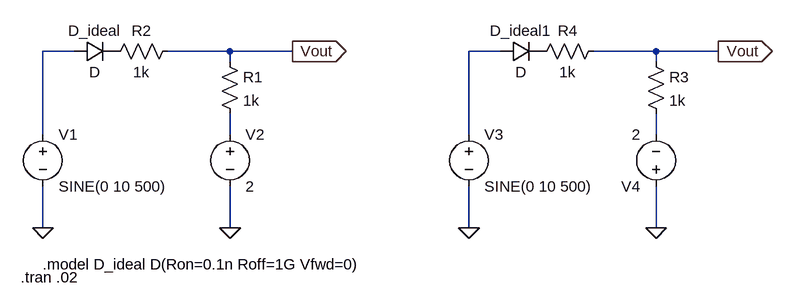
[diagram p0: schematic Q1b.asc]
Q1b.asc, the LTspice schematic file:
Version 4
SHEET 1 1184 680
WIRE 80 80 32 80
WIRE 320 80 224 80
WIRE 416 80 320 80
WIRE 736 80 688 80
WIRE 976 80 880 80
WIRE 1072 80 976 80
WIRE 320 96 320 80
WIRE 976 96 976 80
WIRE 32 208 32 80
WIRE 320 208 320 176
WIRE 688 208 688 80
WIRE 976 208 976 176
WIRE 32 352 32 288
WIRE 320 352 320 288
WIRE 688 352 688 288
WIRE 976 352 976 288
FLAG 32 352 0
FLAG 320 352 0
FLAG 416 80 Vout
IOPIN 416 80 Out
FLAG 688 352 0
FLAG 976 352 0
FLAG 1072 80 Vout
IOPIN 1072 80 Out
SYMBOL voltage 32 192 R0
WINDOW 123 0 0 Left 0
WINDOW 39 0 0 Left 0
SYMATTR InstName V1
SYMATTR Value SINE(0 10 500)
SYMBOL voltage 320 192 R0
WINDOW 123 0 0 Left 0
WINDOW 39 0 0 Left 0
SYMATTR InstName V2
SYMATTR Value 2
SYMBOL res 304 80 R0
SYMATTR InstName R1
SYMATTR Value 1k
SYMBOL res 240 64 R90
WINDOW 0 0 56 VBottom 2
WINDOW 3 32 56 VTop 2
SYMATTR InstName R2
SYMATTR Value 1k
SYMBOL diode 80 96 R270
WINDOW 0 32 32 VTop 2
WINDOW 3 0 32 VBottom 2
SYMATTR InstName D_ideal
SYMATTR SpiceModel D_ideal
SYMBOL voltage 688 192 R0
WINDOW 123 0 0 Left 0
WINDOW 39 0 0 Left 0
SYMATTR InstName V3
SYMATTR Value SINE(0 10 500)
SYMBOL voltage 976 304 R180
WINDOW 123 0 0 Left 0
WINDOW 39 0 0 Left 0
SYMATTR InstName V4
SYMATTR Value 2
SYMBOL res 960 80 R0
SYMATTR InstName R3
SYMATTR Value 1k
SYMBOL res 896 64 R90
WINDOW 0 0 56 VBottom 2
WINDOW 3 32 56 VTop 2
SYMATTR InstName R4
SYMATTR Value 1k
SYMBOL diode 736 96 R270
WINDOW 0 32 32 VTop 2
WINDOW 3 0 32 VBottom 2
SYMATTR InstName D_ideal1
SYMATTR SpiceModel D_ideal
TEXT 32 408 Left 2 !.model D_ideal D(Ron=0.1n Roff=1G Vfwd=0)
TEXT -2 428 Left 2 !.tran .02

The netlist it stands for:
* Q1b.asc
V1 N001 0 SINE(0 10 500)
V2 N003 0 2
R1 Vout N003 1k
R2 Vout P001 1k
D_ideal N001 P001 D_ideal D
V3 N002 0 SINE(0 10 500)
V4 0 N004 2
R3 Vout N004 1k
R4 Vout P002 1k
D_ideal1 N002 P002 D_ideal D
.model D D
.lib standard.dio
.model D_ideal D(Ron=0.1n Roff=1G Vfwd=0)
.tran .02
.backanno
.end